# Altium schematic sheet to_sideXtal_energy_delays.SchDoc
size A4
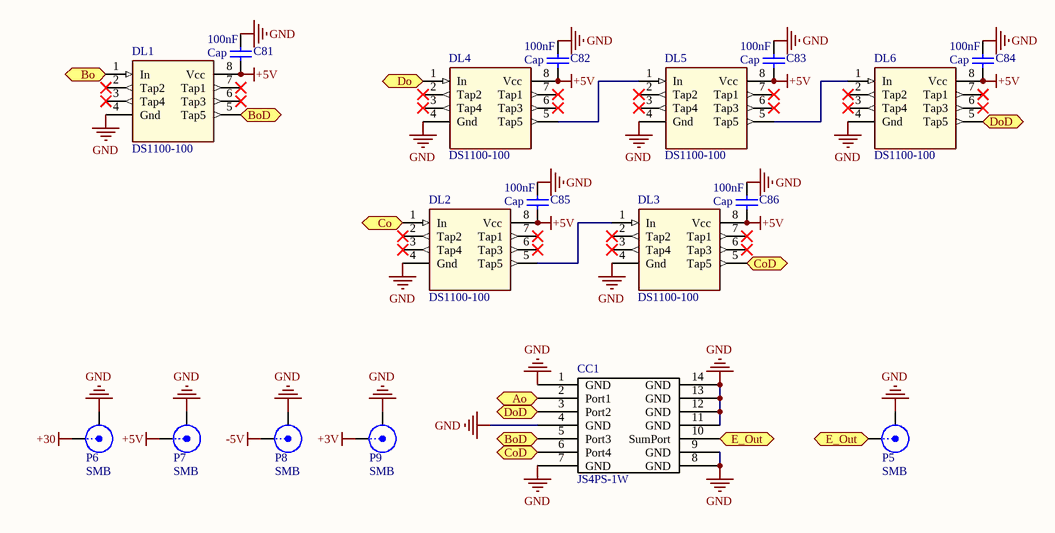
[diagram p0: to_sideXtal_energy_delays.SchDoc]

## Parts
C81  Cap  value 100nF  [0402]
C82  Cap  value 100nF  [0402]
C83  Cap  value 100nF  [0402]
C84  Cap  value 100nF  [0402]
C85  Cap  value 100nF  [0402]
C86  Cap  value 100nF  [0402]
CC1  JS4PS-1W  [JS4PS-1W]
DL1  DS1100-100  [SO8_N]
DL2  DS1100-100  [SO8_N]
DL3  DS1100-100  [SO8_N]
DL4  DS1100-100  [SO8_N]
DL5  DS1100-100  [SO8_N]
DL6  DS1100-100  [SO8_N]
P5  SMB  [SMA-SMD]
P6  SMB  [MHDR1X2]
P7  SMB  [SMA-SMD]
P8  SMB  [SMA-SMD]
P9  SMB  [SMA-SMD]

## Ports
Ao (out), Bo (out), BoD (out), Co (out), CoD (out), Do (out), DoD (out), E_Out (out)

## Nets
+3V: P9.1(X)
+5V: C81.2 C82.2 C83.2 C84.2 C85.2 C86.2 DL1.8(Vcc) DL2.8(Vcc) DL3.8(Vcc) DL4.8(Vcc) DL5.8(Vcc) DL6.8(Vcc) P7.1(X)
+30: P6.1(X)
-5V: P8.1(X)
GND: C81.1 C82.1 C83.1 C84.1 C85.1 C86.1 CC1.1(GND) CC1.4(GND) CC1.7(GND) CC1.8(GND) CC1.9(GND) CC1.11(GND) CC1.12(GND) CC1.13(GND) CC1.14(GND) DL1.4(Gnd) DL2.4(Gnd) DL3.4(Gnd) DL4.4(Gnd) DL5.4(Gnd) DL6.4(Gnd) P5.2(Y) P6.2(Y) P7.2(Y) P8.2(Y) P9.2(Y)
Ao: CC1.2(Port1) ; port Ao
Bo: DL1.1(In) ; port Bo
BoD: CC1.5(Port3) DL1.5(Tap5) ; port BoD
Co: DL2.1(In) ; port Co
CoD: CC1.6(Port4) DL3.5(Tap5) ; port CoD
Do: DL4.1(In) ; port Do
DoD: CC1.3(Port2) DL6.5(Tap5) ; port DoD
E_Out: CC1.10(SumPort) P5.1(X) ; port E_Out
NetDL2_5: DL2.5(Tap5) DL3.1(In)
NetDL4_5: DL4.5(Tap5) DL5.1(In)
NetDL5_5: DL5.5(Tap5) DL6.1(In)

Not connected (* = marked no-connect by the designer): DL1 2(Tap2)* 3(Tap4)* 6(Tap3)* 7(Tap1)*; DL2 2(Tap2)* 3(Tap4)* 6(Tap3)* 7(Tap1)*; DL3 2(Tap2)* 3(Tap4)* 6(Tap3)* 7(Tap1)*; DL4 2(Tap2)* 3(Tap4)* 6(Tap3)* 7(Tap1)*; DL5 2(Tap2)* 3(Tap4)* 6(Tap3)* 7(Tap1)*; DL6 2(Tap2)* 3(Tap4)* 6(Tap3)* 7(Tap1)*

## Library data of the parts
C81-C86 = Cap: Capacitor; Published: 8-Jun-2000; LatestRevisionDate: 17-Jul-2002; LatestRevisionNote: Re-released for DXP Platform.; PackageReference: RAD-0.3; Publisher: Altium Limited; PackageDescription: Radial Cap, Thru-Hole; 2 Leads; 0.3 in Pin Spacing
DL1-DL6 = DS1100-500
P5-P9 = SMB: SMB Straight Connector; LatestRevisionDate: 17-Jul-2002; LatestRevisionNote: Re-released for DXP Platform.; Publisher: Altium Limited